# EasyEDA schematic 1-Schematic_Automatic_temperature_humidity.json
TITLE: Sheet_1; REV: 1.0; Date: 2022-04-04; Sheet: 1/1; Drawn By: 1928272966_ouyang; Company: Your Company
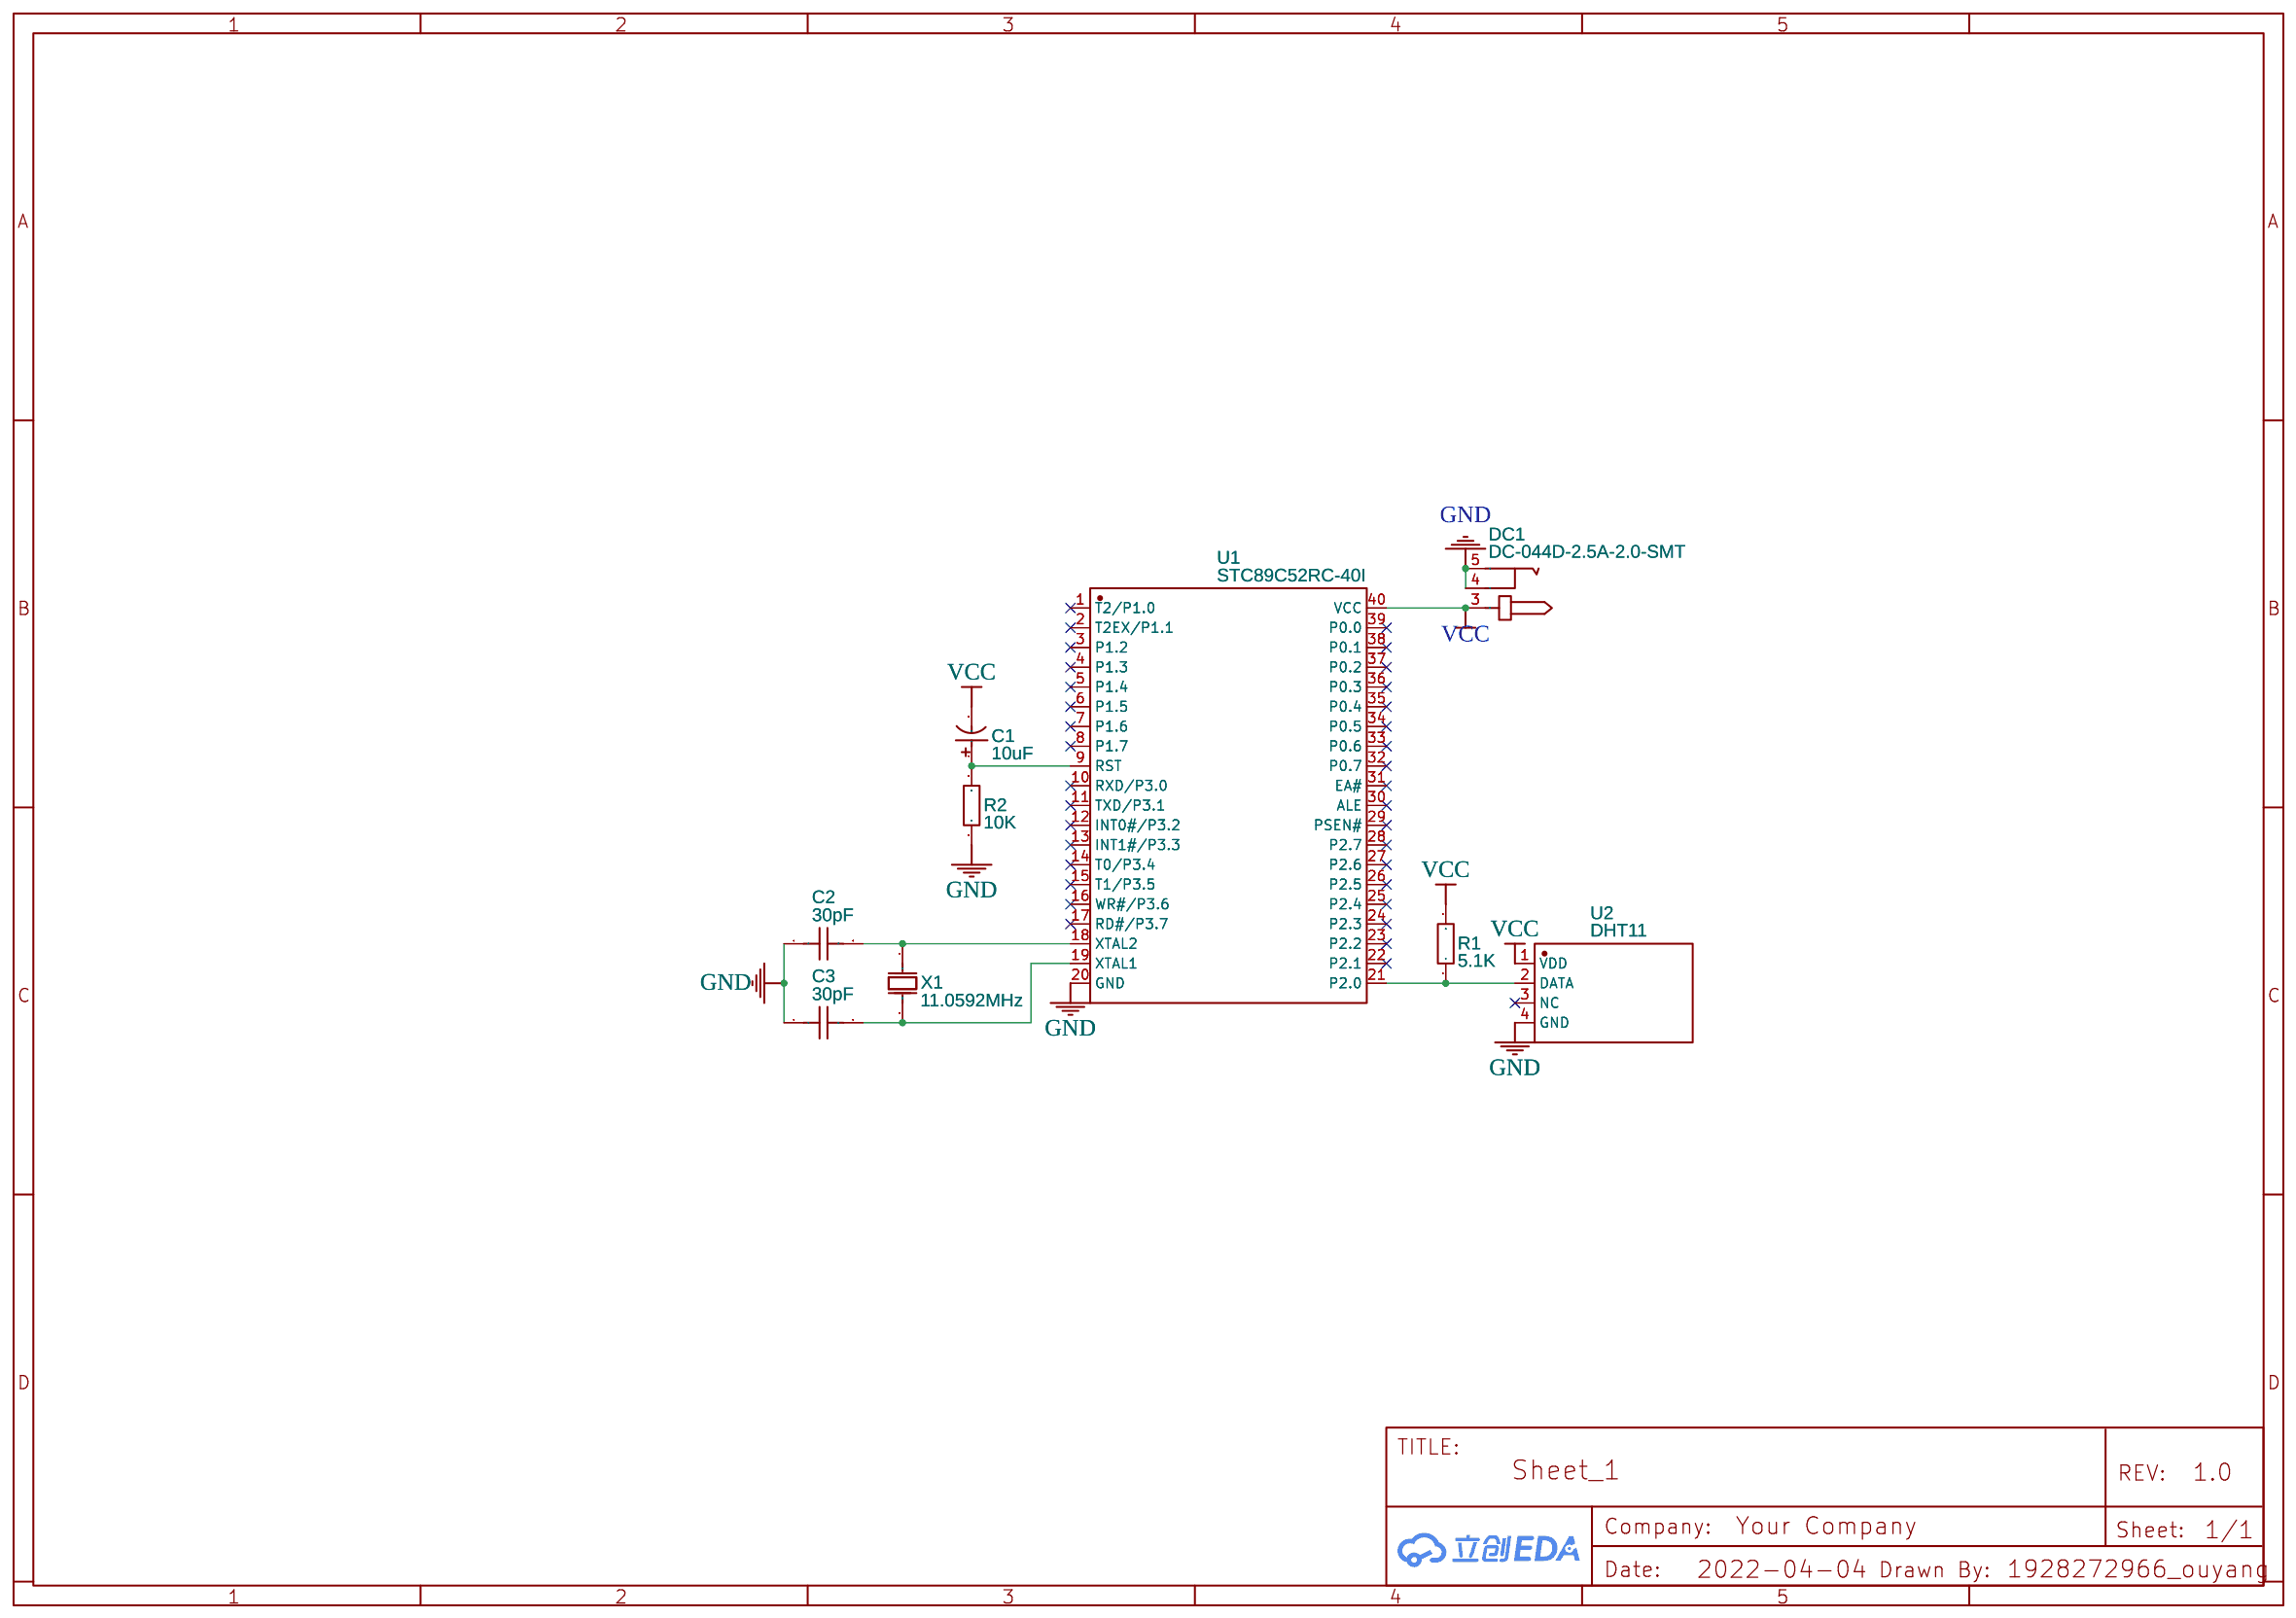
[diagram p0: schematic sheet]

## Parts
C1  10uF  [CAP-TH_BD4.0-P1.50-D0.8-FD]
C2  30pF  [CAP-TH_L5.0-W3.0-P5.00-D0.6-S2.45]
C3  30pF  [CAP-TH_L5.0-W3.0-P5.00-D0.6-S2.45]
DC1  DC-044D-2.5A-2.0-SMT  [DC-IN-SMD_DC-044D-2.5A-2.0-SMT]
R1  5.1K  [RES-TH_BD2.2-L6.5-P10.50-D0.6]
R2  10K  [RES-TH_BD2.5-L6.5-P10.50-D0.6]
U1  STC89C52RC-40I  [DIP-40_L52.0-W13.7-P2.54-LS15.2-BL]
U2  DHT11  [SENSOR-TH_DHT11]
X1  11.0592MHz  [HC-49US_L11.5-W4.5-P4.88]

## Library data of the parts
C1 = 10uF 16V 3*5: Supplier: LCSC; Manufacturer: ValuePro; Supplier Part: C43798; JLCPCB Part Class: Extended Part
C2 C3 = DCC300J20COHF6FJ5A0: Supplier: LCSC; Supplier Part: C2896130; Manufacturer: SHM(南方宏明); Contributor: LCSC
DC1 = DC-044D-2.5A-2.0-SMT: Supplier: LCSC; Supplier Part: C397342; Manufacturer: XKB Enterprise; Contributor: LCSC; JLCPCB Part Class: Extended Part
R1 = MFR0W4F5101A50: Supplier: LCSC; Manufacturer: UniOhm; Supplier Part: C58591; JLCPCB Part Class: Extended Part; Resistance: 5.1kΩ
R2 = MFR0W4F1002A50: Supplier: LCSC; Manufacturer: UniOhm; Supplier Part: C57436; JLCPCB Part Class: Extended Part; Resistance: 10kΩ
U1 = STC89C52RC-40I: Supplier: LCSC; Manufacturer: STC; Supplier Part: C14022; JLCPCB Part Class: Extended Part
U2 = DHT11: Supplier: LCSC; Supplier Part: C117051; Manufacturer: Aosong (Guangzhou) Elec; Contributor: LCSC; JLCPCB Part Class: Extended Part
X1 = X49SD110592MSD2SC: Supplier: LCSC; Manufacturer: YXC; Supplier Part: C2203; JLCPCB Part Class: Extended Part

## Nets
GND: C2.1 C3.1 DC1.4 DC1.5 R2.1 U1.20(GND) U2.4(GND)
VCC: C1.2 DC1.3 R1.2 U1.40(VCC) U2.1(VDD)
Net-(C1-1): C1.1 R2.2 U1.9(RST)
Net-(C2-2): C2.2 U1.18(XTAL2) X1.1(OSC1)
Net-(C3-2): C3.2 U1.19(XTAL1) X1.2(OSC2)
Net-(R1-1): R1.1 U1.21(P2.0) U2.2(DATA)

Not connected (* = marked no-connect by the designer): U1 1(T2/P1.0)* 2(T2EX/P1.1)* 3(P1.2)* 4(P1.3)* 5(P1.4)* 6(P1.5)* 7(P1.6)* 8(P1.7)* 10(RXD/P3.0)* 11(TXD/P3.1)* 12(INT0#/P3.2)* 13(INT1#/P3.3)* 14(T0/P3.4)* 15(T1/P3.5)* 16(WR#/P3.6)* 17(RD#/P3.7)* 22(P2.1)* 23(P2.2)* 24(P2.3)* 25(P2.4)* 26(P2.5)* 27(P2.6)* 28(P2.7)* 29(PSEN#)* 30(ALE)* 31(EA#)* 32(P0.7)* 33(P0.6)* 34(P0.5)* 35(P0.4)* 36(P0.3)* 37(P0.2)* 38(P0.1)* 39(P0.0)*; U2 3(NC)*
